# Altium schematic sheet UNG_8088_EVB_LAN9252-SPI_Copper.SchDoc
size 416 x 264 mm; Revision: A0; SheetNumber: 3; SheetTotal: 4; PageSetup: Record=PageOptions|CenterHorizontal=True|CenterVertical=True|PrintScale=1.02|XCorrection=1.00|YCorrection=1.00|PrintKind=0|BorderSize=5000000|LeftOffset=0|BottomOffset=0|Orientation=2|PaperLength=1000|PaperWidth=1000|Scale=100|PaperSource=15|PrintQuality=-3|MediaType=1|DitherType=10|PrintScaleMode=1|PaperKind=11 x 17|PaperIndex=119; SheetTitle: Change Log; PageTitle: LAN Connectors, Strap & EEPROM; ProjName: JUTLAND; DesignDescription: EVB_LAN9252-SPI; Designer: Manikandan; PartNumber: UNG_8088; DocumentFullPathAndName: //depot_np_hweng_boards/ung_hweng/UNG_8088_FDB_LAN9252-ADD-ON-forF28379D/
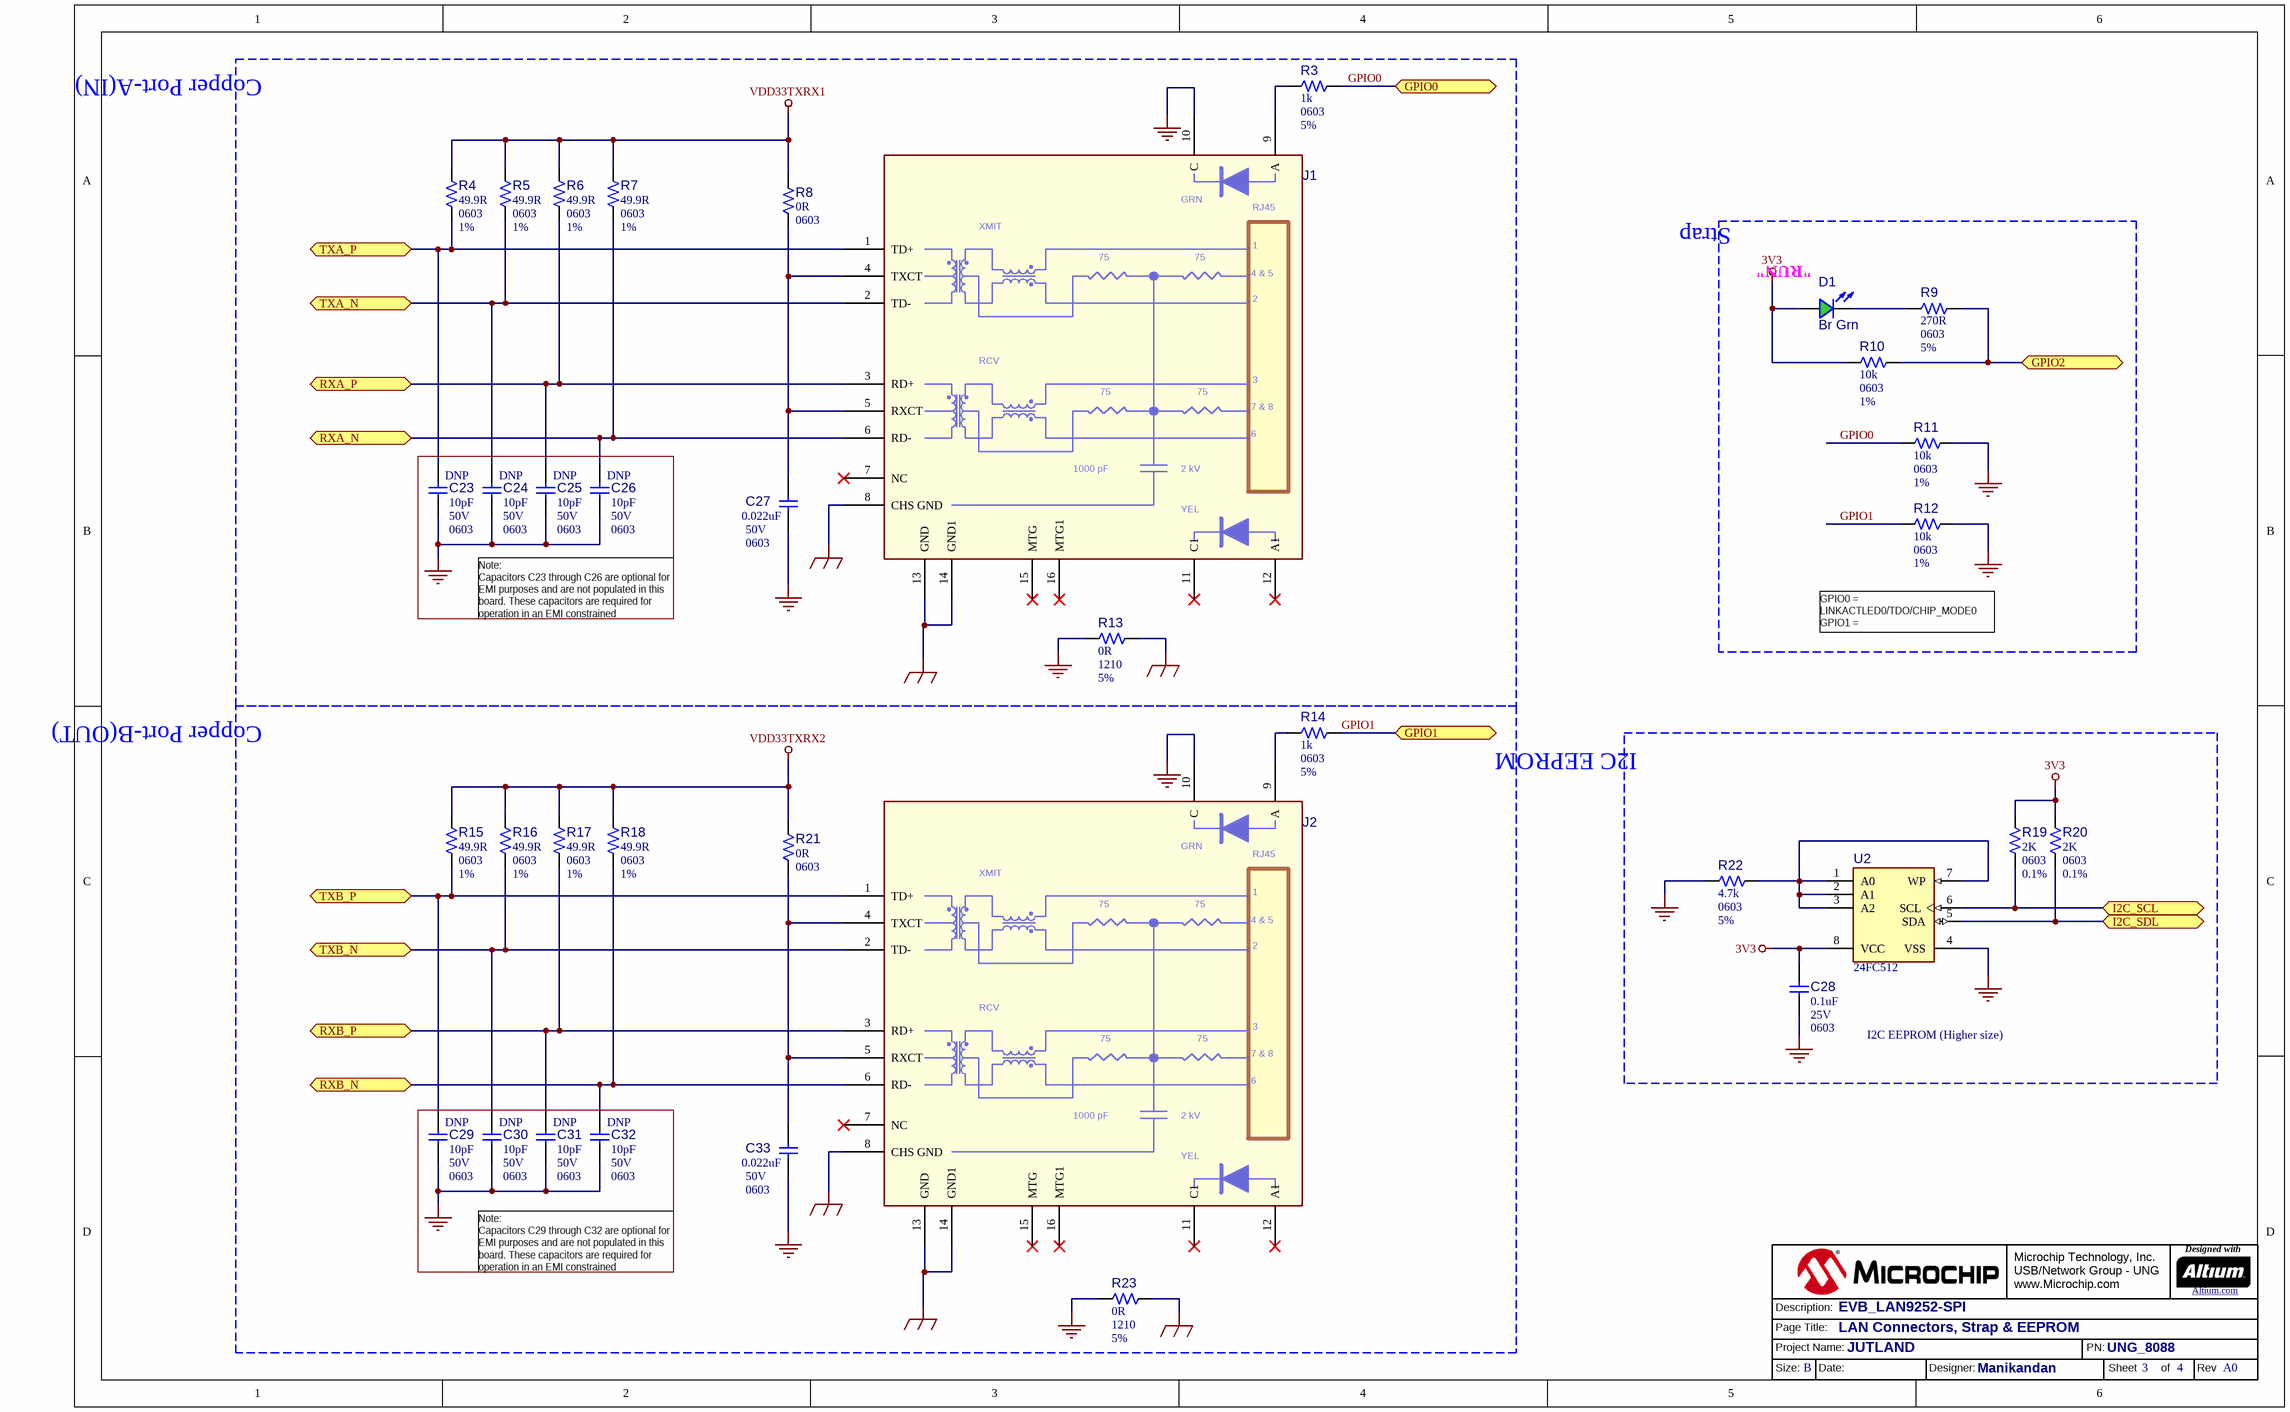
[diagram p0: UNG_8088_EVB_LAN9252-SPI_Copper.SchDoc]

## Parts
?  (no value)  (graphical)
C23  value 10pF  Voltage: 50V  Package: 0603  Populated: DNP  [CAP_C_0603]  (hidden comment: Capacitor NP)
C24  value 10pF  Voltage: 50V  Package: 0603  Populated: DNP  [CAP_C_0603]  (hidden comment: Capacitor NP)
C25  value 10pF  Voltage: 50V  Package: 0603  Populated: DNP  [CAP_C_0603]  (hidden comment: Capacitor NP)
C26  value 10pF  Voltage: 50V  Package: 0603  Populated: DNP  [CAP_C_0603]  (hidden comment: Capacitor NP)
C27  value 0.022uF  Voltage: 50V  Package: 0603  [CAP_C_0603]  (hidden comment: Capacitor NP)
C28  value 0.1uF  Voltage: 25V  Package: 0603  [CAP_C_0603]  (hidden comment: Capacitor NP)
C29  value 10pF  Voltage: 50V  Package: 0603  Populated: DNP  [CAP_C_0603]  (hidden comment: Capacitor NP)
C30  value 10pF  Voltage: 50V  Package: 0603  Populated: DNP  [CAP_C_0603]  (hidden comment: Capacitor NP)
C31  value 10pF  Voltage: 50V  Package: 0603  Populated: DNP  [CAP_C_0603]  (hidden comment: Capacitor NP)
C32  value 10pF  Voltage: 50V  Package: 0603  Populated: DNP  [CAP_C_0603]  (hidden comment: Capacitor NP)
C33  value 0.022uF  Voltage: 50V  Package: 0603  [CAP_C_0603]  (hidden comment: Capacitor NP)
D1  value Br Grn  [LED_0603_GREEN]  (hidden comment: LED, Bright Green, 0603)
J1  CONN RJ45 J0011D01BNL  [RJ45_J0011D01BNL]  (value not drawn)
J2  CONN RJ45 J0011D01BNL  [RJ45_J0011D01BNL]  (value not drawn)
R3  value 1k  Package: 0603  Tolerance: 5%  [RES_C_0603]  (hidden comment: Resistor)
R4  value 49.9R  Package: 0603  Tolerance: 1%  [RES_C_0603]  (hidden comment: Resistor)
R5  value 49.9R  Package: 0603  Tolerance: 1%  [RES_C_0603]  (hidden comment: Resistor)
R6  value 49.9R  Package: 0603  Tolerance: 1%  [RES_C_0603]  (hidden comment: Resistor)
R7  value 49.9R  Package: 0603  Tolerance: 1%  [RES_C_0603]  (hidden comment: Resistor)
R8  value 0R  Package: 0603  [RES_C_0603]  (hidden comment: Resistor)
R9  value 270R  Package: 0603  Tolerance: 5%  [RES_C_0603]  (hidden comment: Resistor)
R10  value 10k  Package: 0603  Tolerance: 1%  [RES_C_0603]  (hidden comment: Resistor)
R11  value 10k  Package: 0603  Tolerance: 1%  [RES_C_0603]  (hidden comment: Resistor)
R12  value 10k  Package: 0603  Tolerance: 1%  [RES_C_0603]  (hidden comment: Resistor)
R13  value 0R  Package: 1210  Tolerance: 5%  [RES_C_1210]  (hidden comment: Resistor)
R14  value 1k  Package: 0603  Tolerance: 5%  [RES_C_0603]  (hidden comment: Resistor)
R15  value 49.9R  Package: 0603  Tolerance: 1%  [RES_C_0603]  (hidden comment: Resistor)
R16  value 49.9R  Package: 0603  Tolerance: 1%  [RES_C_0603]  (hidden comment: Resistor)
R17  value 49.9R  Package: 0603  Tolerance: 1%  [RES_C_0603]  (hidden comment: Resistor)
R18  value 49.9R  Package: 0603  Tolerance: 1%  [RES_C_0603]  (hidden comment: Resistor)
R19  value 2K  Package: 0603  Tolerance: 0.1%  [RES_C_0603]  (hidden comment: Resistor)
R20  value 2K  Package: 0603  Tolerance: 0.1%  [RES_C_0603]  (hidden comment: Resistor)
R21  value 0R  Package: 0603  [RES_C_0603]  (hidden comment: Resistor)
R22  value 4.7k  Package: 0603  Tolerance: 5%  [RES_C_0603]  (hidden comment: Resistor)
R23  value 0R  Package: 1210  Tolerance: 5%  [RES_C_1210]  (hidden comment: Resistor)
U2  24FC512  [SOIC-8]

## Blocks framed on the sheet
Copper Port-A(IN): C23-C27 J1 R3-R8 R13
Strap: D1 R9-R12
Copper Port-B(OUT): C29-C33 J2 R14-R18 R21 R23
I2C EEPROM: C28 R19 R20 R22 U2

## Ports
GPIO0 (bidir), GPIO1 (bidir), GPIO2 (bidir), I2C_SCL (bidir), I2C_SDL (bidir), RXA_N (bidir), RXA_P (bidir), RXB_N (bidir), RXB_P (bidir), TXA_N (bidir), TXA_P (bidir), TXB_N (bidir), TXB_P (bidir)

## Nets
3V3: C28.2 D1.1(A) R10.2 R19.2 R20.2 U2.8(VCC)
Earth1: J1.8(CHS_GND) J1.13(GND) J1.14(GND1) R13.2
Earth2: J2.8(CHS_GND) J2.13(GND) J2.14(GND1) R23.2
GND: C23.1 C24.1 C25.1 C26.1 C27.1 C28.1 C29.1 C30.1 C31.1 C32.1 C33.1 J1.10(C) J2.10(C) R11.1 R12.1 R13.1 R22.1 R23.1 U2.4(VSS)
VDD33TXRX1: R4.2 R5.2 R6.2 R7.2 R8.2
VDD33TXRX2: R15.2 R16.2 R17.2 R18.2 R21.2
GPIO0: R3.2 R11.2 ; port GPIO0
GPIO1: R12.2 R14.2 ; port GPIO1
GPIO2: R9.1 R10.1 ; port GPIO2
I2C_SCL: R19.1 U2.6(SCL) ; port I2C_SCL
I2C_SDL: R20.1 U2.5(SDA) ; port I2C_SDL
RXA_N: C26.2 J1.6(RD-) R7.1 ; port RXA_N
RXA_P: C25.2 J1.3(RD+) R6.1 ; port RXA_P
RXB_N: C32.2 J2.6(RD-) R18.1 ; port RXB_N
RXB_P: C31.2 J2.3(RD+) R17.1 ; port RXB_P
TXA_N: C24.2 J1.2(TD-) R5.1 ; port TXA_N
TXA_P: C23.2 J1.1(TD+) R4.1 ; port TXA_P
TXB_N: C30.2 J2.2(TD-) R16.1 ; port TXB_N
TXB_P: C29.2 J2.1(TD+) R15.1 ; port TXB_P
NetC27_2: C27.2 J1.4(TXCT) J1.5(RXCT) R8.1
NetC33_2: C33.2 J2.4(TXCT) J2.5(RXCT) R21.1
NetD1_2: D1.2(K) R9.2
NetJ1_9: J1.9(A) R3.1
NetJ2_9: J2.9(A) R14.1
NetR22_2: R22.2 U2.1(A0) U2.2(A1) U2.3(A2) U2.7(WP)

Not connected (* = marked no-connect by the designer): J1 7(NC)* 11(C1)* 12(A1)* 15(MTG)* 16(MTG1)*; J2 7(NC)* 11(C1)* 12(A1)* 15(MTG)* 16(MTG1)*

## Notes on the sheet
- (near D1) "RUN"
- Note:
  Capacitors C23 through C26 are optional for EMI purposes and are not populated in this  board. These capacitors are required for operation in an EMI constrained environment.
- GPIO0 = LINKACTLED0/TDO/CHIP_MODE0
  GPIO1 = LINKACTLED1/TDI/CHIP_MODE1
  GPIO2 = RUNLED/E2PSIZE
- I2C EEPROM (Higher size)
- Note:
  Capacitors C29 through C32 are optional for EMI purposes and are not populated in this  board. These capacitors are required for operation in an EMI constrained environment.
- Microchip Technology, Inc.
  USB/Network Group - UNG
  www.Microchip.com
- Designed with
- Altium.com <http://go.altium.com/MicrochipLandingPage_Evaluation.html>
- Page Title:
- Project Name:
- Description:
- PN:
- Size:
- B
- Date:
- Designer:
- Sheet
- of
- Rev
- (in symbol CONN RJ45 TH PULSE J0011D01BNL) GRN; XMIT; 75; 4 & 5; RCV; 7 & 8; 1000 pF; 2 kV; YEL

## Library data of the parts
? = Title Block B_UNG1_Altium
C23-C26 C29-C32 = CAP0142: Capacitor; Manufacturer 1: KEMET; Manufacturer Part Number 1: C0603C100J5GAC; Description_: CAP CER 10pF 50V 5% NP0 SMD 0603; Tolerance: 5%; Temperature Coeffcient: NP0; Type: Ceramic; MCHP-ID: CAP0142; Revision: 1; Status: Production; ComponentLink1URL: https://chn-vm-apps.microchip.com/mchprepo/parts/Datasheets/KEM_C1002_X7R_SMD.pdf; ComponentLink1Description: Datasheet; Operating Temperature: -55C to +125C; Category: Capacitor; Manufacturer 2: KEMET; Manufacturer Part Number 2: C0603C100J5GACTU; Manufacturer 3: TDK; Manufacturer Part Number 3: C1608C0G1H100J; Manufacturer 4: Murata; Manufacturer Part Number 4: GRM1885C1H100JA01D; Supplier 1: KEMET; Supplier Part Number 1: C0603C100J5GAC; Supplier 2: Digi-Key; Supplier Part Number 2: 399-1049-2-ND; Supplier 3: Digi-Key; Supplier Part Number 3: 445-6852-1-ND; Supplier 4: Digi-Key; Supplier Part Number 4: 490-1403-2-ND; Supplier 5: Digi-Key; Supplier Part Number 5: 490-1403-1-ND; Quantity Override: 1
C27 C33 = CAP0625: Capacitor; Manufacturer 1: AVX; Manufacturer Part Number 1: 06035C223JAT2A; Description_: CAP CER 0.022uF 50V 5% X7R SMD 0603; Tolerance: 5%; Temperature Coeffcient: X7R; Type: Ceramic; Populated: YES; MCHP-ID: CAP0625; Revision: 1; Status: Production; ComponentLink1URL: https://chn-vm-apps.microchip.com/mchprepo/parts/Datasheets/smccp.pdf; ComponentLink1Description: Datasheet; Operating Temperature: -55C to +125C; Category: Capacitor; Supplier 1: Digi-Key; Supplier Part Number 1: 478-3722-2-ND; Quantity Override: 1
C28 = CAP0012: Capacitor; Manufacturer 1: Cal-Chip; Manufacturer Part Number 1: GMC10Y5V104Z25NTLF; Description_: CAP CER 0.1uF 25V 20% Y5V SMD 0603; Tolerance: 20%; Temperature Coeffcient: Y5V; Type: Ceramic; Populated: Yes; MCHP-ID: CAP0012; Revision: 1; Status: Production; ComponentLink1URL: https://chn-vm-apps.microchip.com/mchprepo/parts/Datasheets/nmc2.pdf; ComponentLink1Description: Datasheet; Operating Temperature: -30C to + 85C; Category: Capacitor; Manufacturer 2: NIC Components; Manufacturer Part Number 2: NMC0603Y5V104Z25TRPF; Manufacturer 3: Panasonic; Manufacturer Part Number 3: ECJ-1VF1E104Z; Manufacturer 4: ROHM; Manufacturer Part Number 4: MCH182FN104ZK; Manufacturer 5: Murata; Manufacturer Part Number 5: GRM188F51E104ZA01D; Supplier 1: Cal-Chip; Supplier Part Number 1: GMC10Y5V104Z25NTLF; Supplier 2: NIC Components; Supplier Part Number 2: NMC0603Y5V104Z25TRPF; Supplier 3: Digi-Key; Supplier Part Number 3: PCC1794TR-ND; Supplier 4: ROHM; Supplier Part Number 4: MCH182FN104ZK; Supplier 5: Raynen; Supplier Part Number 5: 490-1575-1-ND; Quantity Override: 1
D1 = LED, Bright Green, 0603: Manufacturer 1: Lite-On; Manufacturer Part Number 1: LTST-C191KGKT; Type: LED Single; Forward Current: 20mA; MCD: 35mcd; Owner: Jennifer Hancock; Viewing Angle: 130°; Revision: -; Description_: LED, Bright Green, 0603; Package: 0603 (1608 Metric); ComponentLink1URL: http://optoelectronics.liteon.com/upload/download/DS22-2000-228/S_110_LTST-C191KGKT.pdf; ComponentLink1Description: Datasheet; Category: Diode; Mounting Type: Surface Mount; Supplier 1: Digi-Key; Supplier Part Number 1: 160-1446-6-ND
J1 J2 = CONN RJ45 TH PULSE J0011D01BNL: Owner: Manikandan; Populated: YES; Description_: CONN RJ45 TH PULSE J0011D01BNL; ComponentLink1URL: http://www.digikey.com/product-search/en?keywords=J0011D01BNL; ComponentLink1Description: Datasheet; Package: RJ45; Type: Connector; Category: Interconnects; Manufacturer 1: Pulse; Manufacturer Part Number 1: J0011D01BNL; Supplier 1: Digi-Key; Supplier Part Number 1: 553-1483-ND; ROHS: Yes
R3 R14 = RES1128: Manufacturer 1: Panasonic; Manufacturer Part Number 1: ERJ-3GEYJ102V; Description_: RES TKF 1k 5% 1/10W SMD 0603; Voltage: 75V; Temperature Coeffcient: 200ppm/C; Power: 1/10W; Owner: Bogdan P (M91398); Populated: Yes; MCHP-ID: RES1128; Revision: 0; Status: Production; ComponentLink1URL: https://chn-vm-apps.microchip.com/mchprepo/parts/Datasheets/AOA0000CE1.pdf; ComponentLink1Description: Datasheet; Operating Temperature: -55C to +155C; Category: Resistor; Type: RES SMD; Composition: TKF; Supplier 1: Digi-Key; Supplier Part Number 1: P1.0KGCT-ND; Quantity Override: 1
R4-R7 R15-R18 = RES1188: Manufacturer 1: Panasonic; Manufacturer Part Number 1: ERJ-3EKF49R9V; Description_: RES TKF 49.9R 1% 1/10W SMD 0603; Voltage: 75V; Temperature Coeffcient: 100ppm/C; Power: 1/10W; Owner: Adrian T (M91397); Populated: Yes; MCHP-ID: RES1188; Revision: 0; Status: Production; ComponentLink1URL: https://chn-vm-apps.microchip.com/mchprepo/parts/Datasheets/AOA0000CE2.pdf; ComponentLink1Description: Datasheet; Operating Temperature: -55C to +155C; Category: Resistor; Type: RES SMD; Composition: TKF; Supplier 1: Digi-Key; Supplier Part Number 1: P49.9HCT-ND; Quantity Override: 1
R8 R21 = RSMT0001: Manufacturer 1: NIC Components; Manufacturer Part Number 1: NRC06Z0TRF; Description_: RES TKF 0R 1/10W SMD 0603; Power: 1/10W; Populated: Yes; MCHP-ID: RSMT0001; Revision: 2; Status: Production; ComponentLink1URL: https://chn-vm-apps.microchip.com/mchprepo/parts/Datasheets/nrc.pdf; ComponentLink1Description: Datasheet; Operating Temperature: -55C to +155C; Category: Resistor; Type: RES SMD; Composition: TKF; Manufacturer 2: Panasonic; Manufacturer Part Number 2: ERJ-3GSY0R00V; Manufacturer 3: Panasonic; Manufacturer Part Number 3: ERJ-3GEY0R00V; Manufacturer 4: Stackpole Electronics Inc; Manufacturer Part Number 4: RMCF0603ZT0R00; Manufacturer 5: Vishay; Manufacturer Part Number 5: CRCW06030000Z0EA; Manufacturer 6: Stackpole Electronics Inc; Manufacturer Part Number 6: RMCF 1/16 0 R; Manufacturer 7: Yageo; Manufacturer Part Number 7: RC0603JR-070RL; Manufacturer 8: KOA Speer; Manufacturer Part Number 8: RK73Z1JTTP; Manufacturer 9: ROHM; Manufacturer Part Number 9: MCR03EZPJ000; Supplier 1: NIC Components; Supplier Part Number 1: NRC06Z0TRF; Supplier 2: Digi-Key; Supplier Part Number 2: P0.0GTR-ND; Supplier 3: Digi-Key; Supplier Part Number 3: RMCF0603ZT0R00TR-ND; Supplier 4: Digi-Key; Supplier Part Number 4: RMCF0603ZT0R00CT-ND; Supplier 5: Digi-Key; Supplier Part Number 5: 541-0.0GCT-ND; Supplier 6: Digi-Key; Supplier Part Number 6: RMCF1/160RTR-ND; Supplier 7: Digi-Key; Supplier Part Number 7: 311-0.0GRCT-ND; Supplier 8: KOA Speer; Supplier Part Number 8: RK73Z1JTTP; Supplier 9: Digi-Key; Supplier Part Number 9: RHM0.0GCT-ND; Quantity Override: 1
R9 = RES1150: Manufacturer 1: Panasonic; Manufacturer Part Number 1: ERJ-3GEYJ271V; Description_: RES TKF 270R 5% 1/10W SMD 0603; Dev Tools Status: Production; Voltage: 75V; Temperature Coeffcient: 200ppm/C; Power: 1/10W; Owner: Bogdan P (M91398); Populated: Yes; MCHP-ID: RES1150; Revision: 0; Status: MCL Design; ComponentLink1URL: https://chn-vm-apps.microchip.com/mchprepo/parts/Datasheets/AOA0000CE1.pdf; ComponentLink1Description: Datasheet; Operating Temperature: -55C to +155C; Category: Resistor; Type: RES SMD; Composition: TKF; Supplier 1: Digi-Key; Supplier Part Number 1: P270GCT-ND; Quantity Override: 1
R10-R12 = RES1368: Manufacturer 1: TE Connectivity; Manufacturer Part Number 1: 5-1879337-9; Description_: RES TF 10k 1% 1/16W SMD 0603; Voltage: 100V; Temperature Coeffcient: 50ppm/C; Circuit Type: Isolated; Power: 1/16W; Owner: Jairuz Agang-ang; Populated: YES; MCHP-ID: RES1368; Revision: 1; Status: Production; ComponentLink1URL: https://chn-vm-apps.microchip.com/mchprepo/parts/Datasheets/ENG_DS_1773200_H.pdf; ComponentLink1Description: Datasheet; Operating Temperature: -55C to +155C; Category: Resistor; Type: RES SMD; Composition: TF; Supplier 1: Digi-Key; Supplier Part Number 1: A102203CT-ND; Quantity Override: 1
R13 R23 = RSMT0610: Manufacturer 1: Vishay; Manufacturer Part Number 1: CRCW12100000Z0EA; Description_: RES TKF 0R 1/3W SMD 1210; Power: 1/3W; Populated: Yes; MCHP-ID: RSMT0610; Revision: 1; Status: Production; ComponentLink1URL: https://chn-vm-apps.microchip.com/mchprepo/parts/Datasheets/dcrcwe3.pdf; ComponentLink1Description: Datasheet; Operating Temperature: -55C to +155C; Category: Resistor; Type: RES SMD; Composition: TKF; Supplier 1: Digi-Key; Supplier Part Number 1: 541-0.0VCT-ND; Quantity Override: 1
R19 R20 = RES1693: Manufacturer 1: Yageo; Manufacturer Part Number 1: RT0603BRD072KL; Description_: RES SMD 2K OHM 0.1% 1/10W 0603; Dev Tools Status: Design; Temperature Coeffcient: ±25ppm/°C; Power: 0.1W, 1/10W; Owner: Jose Garcia; Populated: YES; MCHP-ID: RES1693; Revision: 1; Symbol: Resistor; Status: MCL Design; ComponentLink1Description: Datasheet; Operating Temperature: -55°C ~ 155°C; Category: Resistor; Type: RES SMD; Composition: TF; Supplier 1: Digi-Key; Supplier Part Number 1: YAG1626CT-ND; Quantity Override: 1
R22 = RES1178: Manufacturer 1: Panasonic; Manufacturer Part Number 1: ERJ-3GEYJ472V; Description_: RES TKF 4.7k 5% 1/10W SMD 0603; Dev Tools Status: Production; Voltage: 75V; Temperature Coeffcient: 200ppm/C; Power: 1/10W; Owner: Bogdan P (M91398); Populated: Yes; MCHP-ID: RES1178; Revision: 0; Symbol: Resistor; Status: MCL Design; ComponentLink1URL: https://chn-vm-apps.microchip.com/mchprepo/parts/Datasheets/AOA0000CE1.pdf; ComponentLink1Description: Datasheet; Operating Temperature: -55C to +155C; Category: Resistor; Type: RES SMD; Composition: TKF; Supplier 1: Digi-Key; Supplier Part Number 1: P4.7KGCT-ND; Quantity Override: 1
U2 = 24FC512: EEPROM I2C; Manufacturer 1: Microchip; Manufacturer Part Number 1: 24FC512T-I/SN; Description_: MCHP MEMORY SERIAL EEPROM 512k I2C 24FC512-I/SN SOIC-8; Symobl: 24XXXX SOIC-8; MAPS Description: 512K, 64K X 8 2.5V SERIAL EE, IND; Dev Tools Status: Production; PackingMedia: T/R; TempRange: -40C to +85C; LeadCount: 8; PackageWidth: 3.90mm(.150in); LeadContent: Pb-FREE; MemorySizeNum: 512000; OpVoltMin: 2.5; OpVoltMax: 5.5; MaxClockFreq: 400 kHz; AddressPins: 3; WPScheme: Full Array; MemoryOrg: x8; Populated: Yes; Type: Serial EEPROM; Category: MCHP-Memory; ComponentLink1URL: http://www.microchip.com/wwwproducts/en/24FC512; ComponentLink1Description: Datasheet; Manufacturer 2: Microchip; Manufacturer Part Number 2: 24FC512-I/SN; Supplier 1: Microchip; Supplier Part Number 1: 24FC512T-I/SN; Supplier 2: Microchip; Supplier Part Number 2: 24FC512-I/SN; PackageType: SOIC; Quantity Override: 1; Value: 24FC512